# Altium schematic sheet USB.SchDoc
size A4
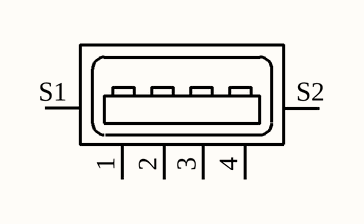
[diagram p0: USB.SchDoc]

## Parts
J7  UJ2-AH-1-SMT  [CUI_UJ2-AH-1-SMT_UJ2-AH-1-SMT(Primary)]  (value not drawn)

## Nets

Not connected (* = marked no-connect by the designer): J7 1 2 3 4 S1(SHIELD) S2(SHIELD)

## Library data of the parts
J7 = UJ2-AH-1-SMT: Standard A type 4 pin Horizontal 3 Âµin Plating SMT USB 2.0 Jack; MP: UJ2-AH-1-SMT-TR; MF: CUI Inc.; CUI_purchase_URL: https://www.cui.com/product/interconnect/usb-connectors/type-a/uj2-ah-smt-series?utm_source=snapeda.com&utm_medium=referral&utm_campaign=snapedaBOM; Package: None; Availability: Unavailable; SnapEDA_Link: https://www.snapeda.com/parts/UJ2-AH-1-SMT-TR/CUI%20Inc./view-part/?ref=snap; Price: None; Value: *